# Altium project Sonar.PrjPCB
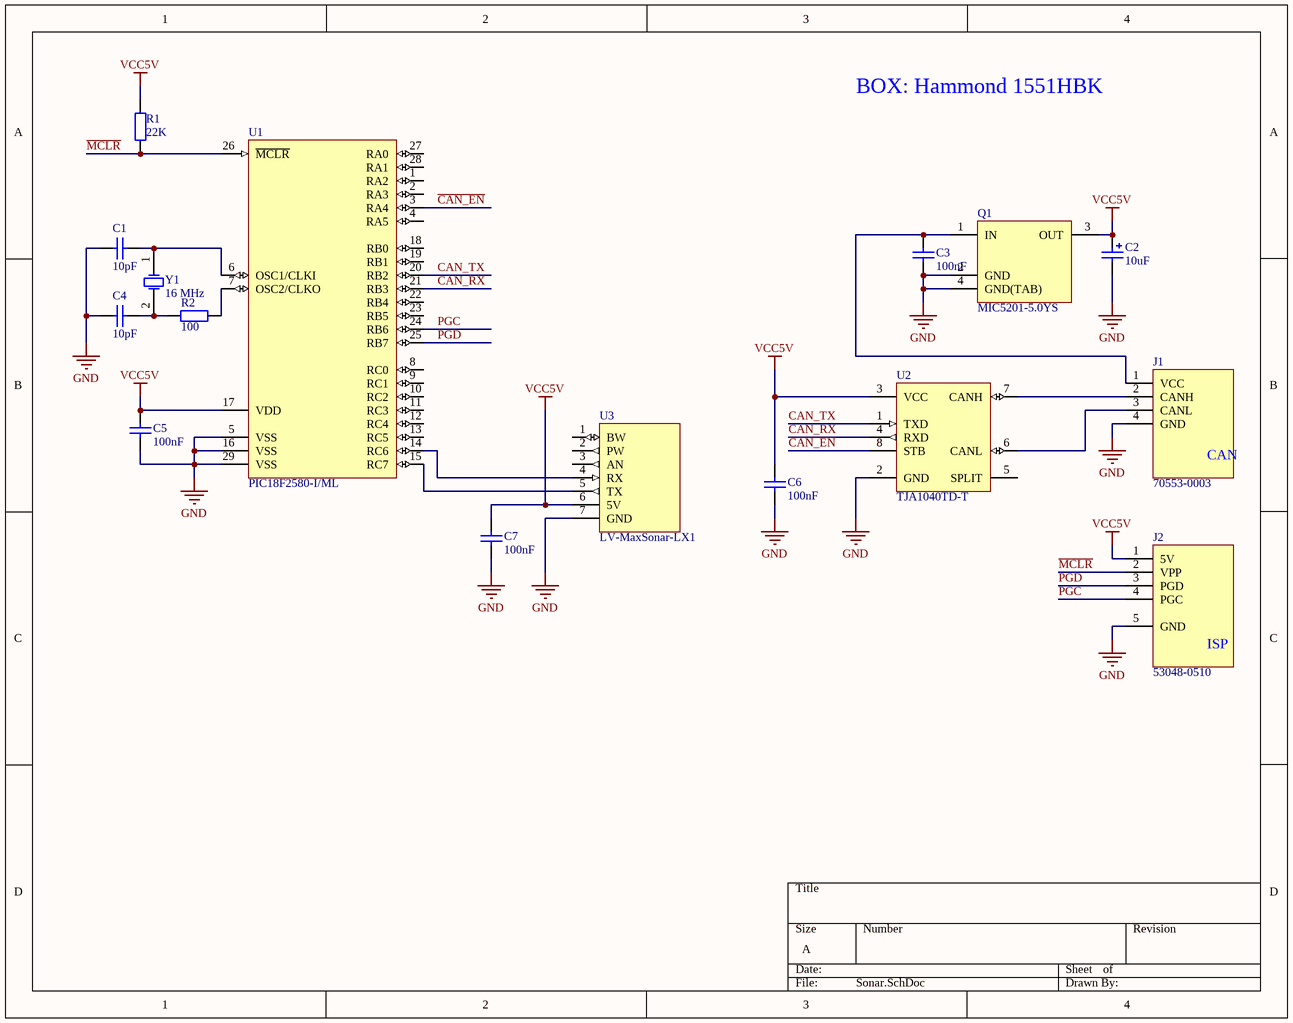
[diagram p0: Sonar.SchDoc]
1 sheet, 16 parts. Net scope: global (net labels, ports and power ports of the same name join across sheets).
Board file: Sonar.PcbDoc

## Sheet Sonar.SchDoc
size A

### Parts
C1  value 10pF  [CC1608-0603]  (hidden comment: Cap)
C2  value 10uF  [TC3528-1411]  (hidden comment: TPSB106K016R0800)
C3  value 100nF  [CC1608-0603]  (hidden comment: UMK107BJ104KA-T)
C4  value 10pF  [CC1608-0603]  (hidden comment: Cap)
C5  value 100nF  [CC1608-0603]  (hidden comment: UMK107BJ104KA-T)
C6  value 100nF  [CC1608-0603]  (hidden comment: UMK107BJ104KA-T)
C7  value 100nF  [CC1608-0603]  (hidden comment: UMK107BJ104KA-T)
J1  70553-0003  [CON_CAN_Device-4]
J2  53048-0510  [CON_ISP_H]
Q1  MIC5201-5.0YS  [DSO-G3]
R1  value 22K  [CR1608-0603]  (hidden comment: Res)
R2  value 100  [CR1608-0603]  (hidden comment: Res)
U1  PIC18F2580-I/ML  [QFN6X6-28]
U2  TJA1040TD-T  [SO-G8/E2.9]
U3  LV-MaxSonar-LX1  [MaxSonar]
Y1  value 16 MHz  [CS10]  (hidden comment: CS10-16.000MABJ-UT)

### Nets
GND: C1.1 C2.2 C3.2 C4.1 C5.2 C6.2 C7.2 J1.4(GND) J2.5(GND) Q1.2(GND) Q1.4(GND(TAB)) U1.5(VSS) U1.16(VSS) U1.29(VSS) U2.2(GND) U3.7(GND)
VCC5V: C2.1 C5.1 C6.1 C7.1 J2.1(5V) Q1.3(OUT) R1.2 U1.17(VDD) U2.3(VCC) U3.6(5V)
~{CAN_EN}: U1.3(RA4) U2.8(STB)
CAN_RX: U1.21(RB3) U2.4(RXD)
CAN_TX: U1.20(RB2) U2.1(TXD)
~{MCLR}: J2.2(VPP) R1.1 U1.26(~{MCLR})
PGC: J2.4(PGC) U1.24(RB6)
PGD: J2.3(PGD) U1.25(RB7)
NetC1_2: C1.2 U1.6(OSC1/CLKI) Y1.1(OSC1)
NetC3_1: C3.1 J1.1(VCC) Q1.1(IN)
NetC4_2: C4.2 R2.2 Y1.2(OSC2)
NetJ1_2: J1.2(CANH) U2.7(CANH)
NetJ1_3: J1.3(CANL) U2.6(CANL)
NetR2_1: R2.1 U1.7(OSC2/CLKO)
NetU1_14: U1.14(RC6) U3.4(RX)
NetU1_15: U1.15(RC7) U3.5(TX)

Not connected (* = marked no-connect by the designer): U1 1(RA2) 2(RA3) 4(RA5) 8(RC0) 9(RC1) 10(RC2) 11(RC3) 12(RC4) 13(RC5) 18(RB0) 19(RB1) 22(RB4) 23(RB5) 27(RA0) 28(RA1); U2 5(SPLIT); U3 1(BW) 2(PW) 3(AN)

### Notes on the sheet
- BOX: Hammond 1551HBK
- (in symbol CON_CAN_DEVICE) CAN
- (in symbol CON_ISP_Header_5p_1.25mm_horizontal) ISP

### Library data of the parts
C1 C4 = Cap: Capacitor; Manufacturer: Panasonic; OrderCode: ECJ-1VC1H100D; Distributor: Digikey
C2 = Cap Pol: Polarized Capacitor (Surface Mount); Manufacturer: AVX; Distributor: Digikey; OrderCode: TPSB106K016R0800
C3 C5-C7 = Cap: Capacitor; Manufacturer: Taiyo Yuden; Distributor: Digikey; OrderCode: UMK107BJ104KA-T
J1 = CON_CAN_DEVICE: 4 pin CAN Connector 2.54mm pitch; Manufacturer: Molex; Distributor: Digikey; OrderCode: 70553-0003
J2 = CON_ISP_Header_5p_1.25mm_horizontal: 6 pin header - 1.25mm pitch horizontal; Manufacturer: Molex; OrderCode: 53048-0510 + 51021-0500 + 5 x 50079-8000; Distributor: Digikey
Q1 = MIC5201-5.0YS: 5V LDO 200mA; Manufacturer: Micrel; OrderCode: MIC5201-5.0YS; Distributor: Digikey
R1 R2 = Res: Resistor; Distributor: Digikey
U1 = PIC18F2580-I/ML: 8 bit CAN MCU; Manufacturer: Microchip; Distributor: Digikey; OrderCode: PIC18F2580-I/ML
U2 = TJA1040TD-T: 5V CAN Transceiver; Manufacturer: NXP; OrderCode: TJA1040TD-T; Distributor: Digikey
U3 = MaxSonar_LX1: Maxbotix ultrasound range sensor; Manufacturer: Maxbotix
Y1 = CS10: Crystal Oscillator; Manufacturer: Citizen; Distributor: Digikey; OrderCode: CS10-16.000MABJ-UT